# EAGLE schematic RPi (EAGLE 9.5.1)
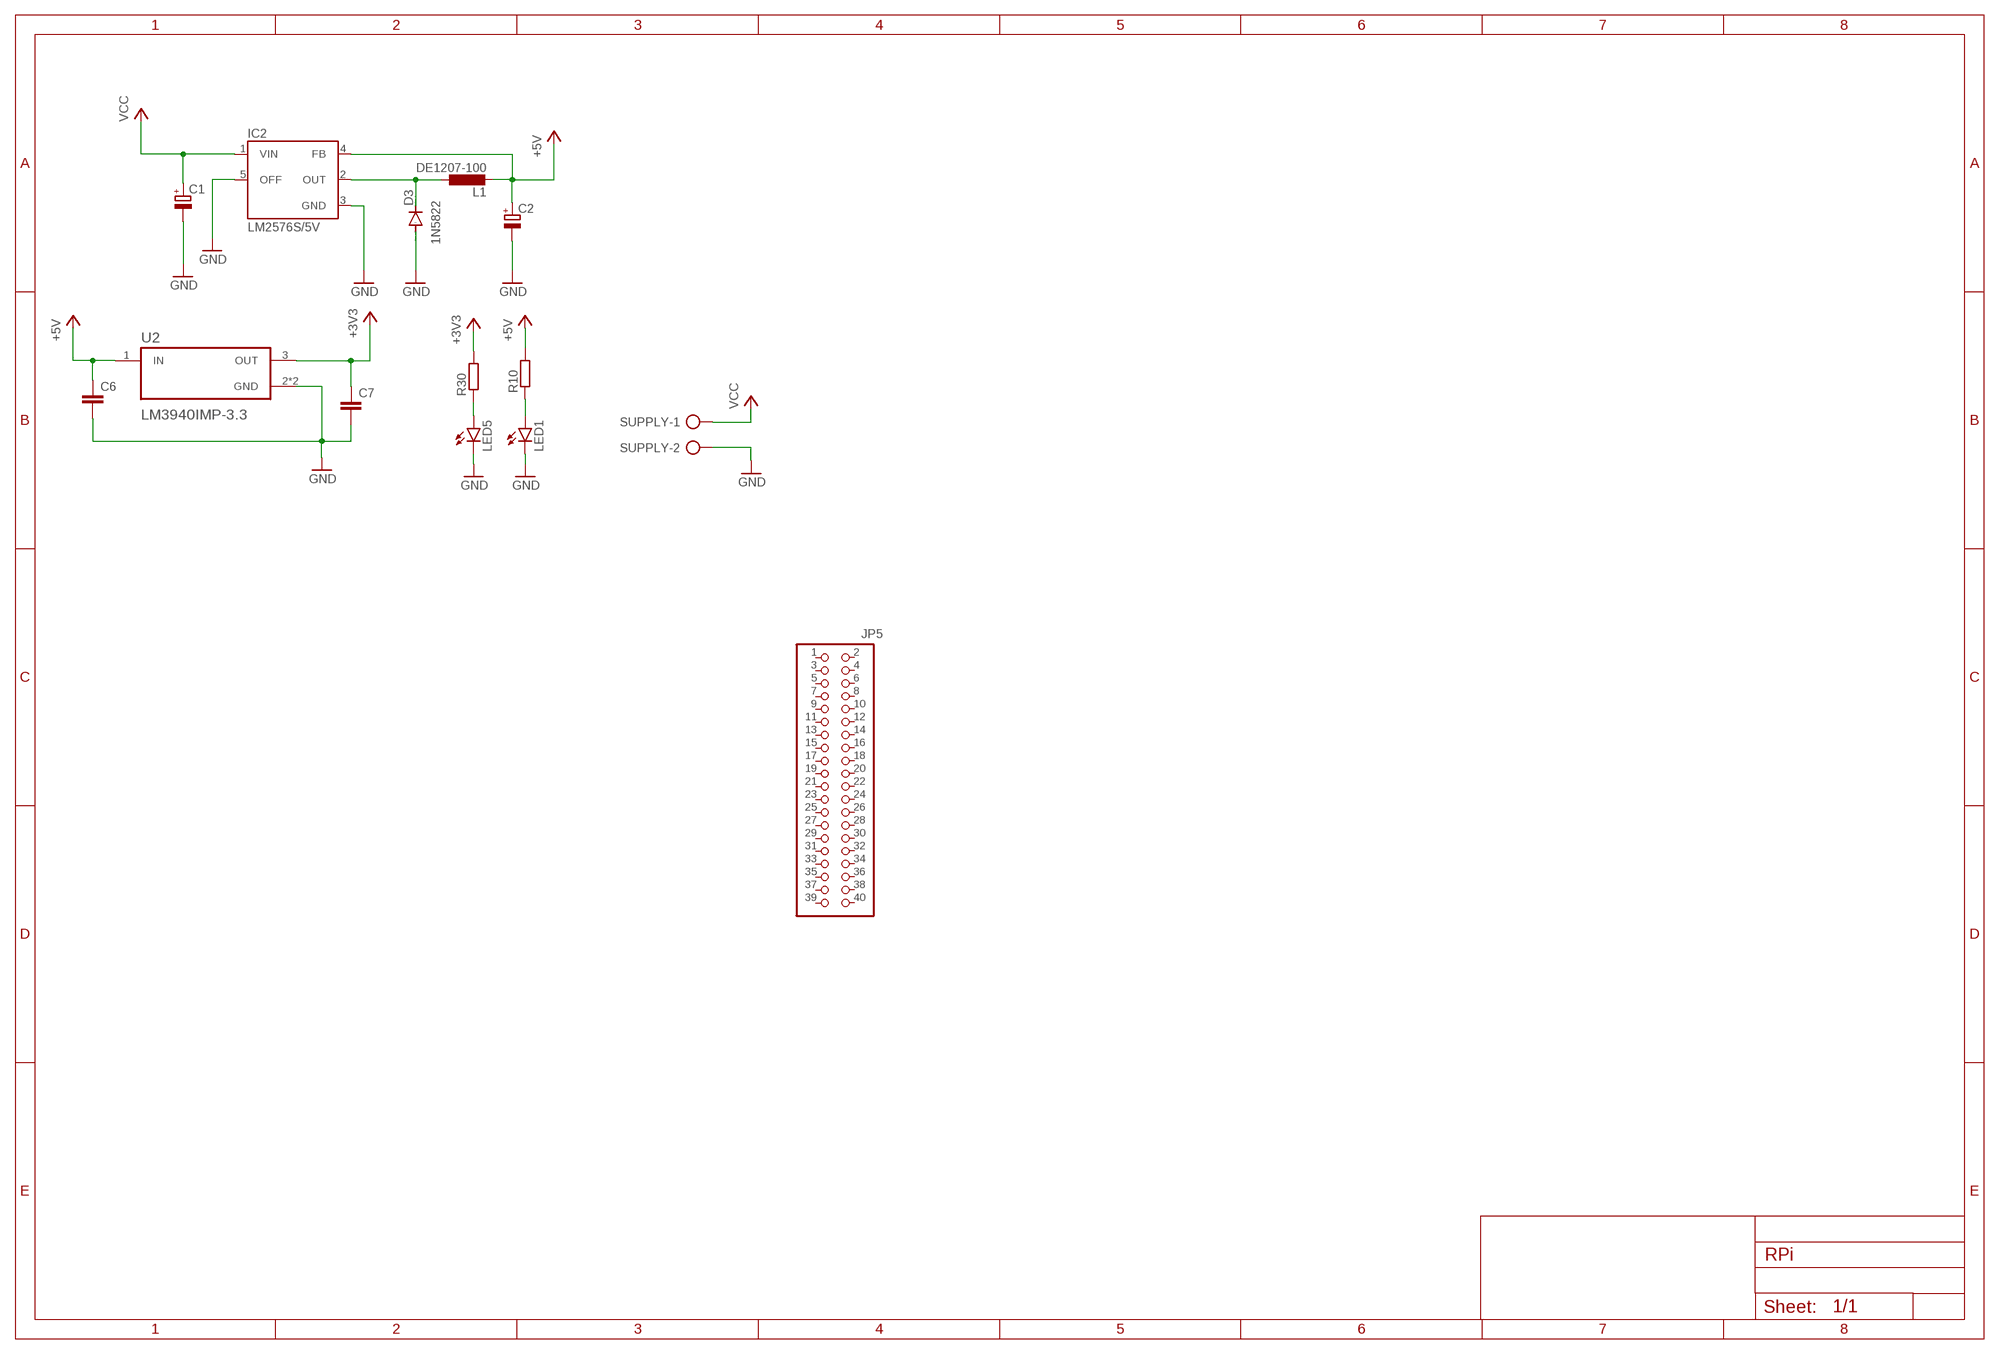
[diagram p0: schematic, sheet 1]

## Parts
C1  CPOL-EUE2.5-6  [E2,5-6]
C2  CPOL-EUE2.5-6  [E2,5-6]
C6  C-EUC0805K  [C0805K]
C7  C-EUC0805K  [C0805K]
D3  1N5822  1N4004  [DO41-10]
IC2  LM2576S/5V  LM2576S  [TO263-5]
JP5  PINHD-2X20  [2X20]
L1  DE1207-100  [DE1207]
LED1  LEDSML0805  [SML0805]
LED5  LEDSML0805  [SML0805]
R10  R-EU_R0805  [R0805]
R30  R-EU_R0805  [R0805]
SUPPLY  AK500/2-H  [AK500/2-H]
U2  LM3940IMP-3.3  [SOT230P700X180-4N]

## Nets
+3V3: C7.1 R30.2 U2.3(OUT)
+5V: C2.+ C6.1 IC2.4(FB) L1.2 R10.2 U2.1(IN)
GND: C1.- C2.- C6.2 C7.2 D3.A IC2.3(GND) IC2.5(OFF) LED1.C LED5.C SUPPLY.2 U2.2(GND) U2.4(GND)
N$3: LED1.A R10.1
N$19: D3.C IC2.2(OUT) L1.1
N$23: LED5.A R30.1
VCC: C1.+ IC2.1(VIN) SUPPLY.1
Unconnected: JP5.1 JP5.2 JP5.3 JP5.4 JP5.5 JP5.6 JP5.7 JP5.8 JP5.9 JP5.10 JP5.11 JP5.12 JP5.13 JP5.14 JP5.15 JP5.16 JP5.17 JP5.18 JP5.19 JP5.20 JP5.21 JP5.22 JP5.23 JP5.24 JP5.25 JP5.26 JP5.27 JP5.28 JP5.29 JP5.30 JP5.31 JP5.32 JP5.33 JP5.34 JP5.35 JP5.36 JP5.37 JP5.38 JP5.39 JP5.40

## Library data of the parts
C1 C2 = rcl:CPOL-EU: POLARIZED CAPACITOR, European symbol; SPICEPREFIX: C
C6 C7 = rcl:C-EU: CAPACITOR, European symbol; SPICEPREFIX: C
D3 = diode:1N4004: DIODE general purpose rectifier, 1 A
IC2 = v-reg-3:LM2576: National Semiconductor <http://www.national.com> 3.0A "Simple Switcher"(c) 52kHz, Vout 1.23-37V (HV: 57V), Vin 40V (HV: 60V), 50µA standby current
JP5 = pinhead:PINHD-2X20: PIN HEADER
L1 = ferrocore:DE1207-100: SMD power coil 100 uH
LED1 LED5 = led:LED: LED OSRAM: - CHIPLED LG R971, LG N971, LY N971, LG Q971, LY Q971, LO R971, LY R971 LH N974, LH R974 LS Q976, LO Q976, LY Q976 LO Q996 - Hyper CHIPLED LW Q18S LB Q993, LB Q99A, LB R99A - SideLED LS A670, LO A670, LY A670, LG A670, LP A670 LB A673, LV A673, LT A673, LW A673 LH A674 LY A675 LS A676, LA A676, LO A676, LY A676, LW A676 LS A679, LY A679, LG A679 - Hyper Micro SIDELED® LS Y876, LA Y876, LO Y876, LY Y876 LT Y87S - SmartLED LW L88C, LW L88S LB L89C, LB L89S, LG L890 LS L89K, LO L89K, LY L89K LS L896, LA L896, LO L896, LY L896 - TOPLED LS T670, LO T670, LY T670, LG T670, LP T670 LSG T670, LSP T670, LSY T670, LOP T670, LYG T670 LG T671, LOG T671, LSG T671 LB T673, LV T673, LT T673, LW T673 LH T674 LS T676, LA T676, LO T676, LY T676, LB T676, LH T676, LSB T676, LW T676 LB T67C, LV T67C, LT T67C, LS T67K, LO T67K, LY T67K, LW E67C LS E67B, LA E67B, LO E67B, LY E67B, LB E67C, LV E67C, LT E67C LW T67C LS T679, LY T679, LG T679 LS T770, LO T770, LY T770, LG T770, LP T770 LB T773, LV T773, LT T773, LW T773 LH T774 LS E675, LA E675, LY E675, LS T675 LS T776, LA T776, LO T776, LY T776, LB T776 LHGB T686 LT T68C, LB T68C - Hyper Mini TOPLED® LB M676 - Mini TOPLED Santana® LG M470 LS M47K, LO M47K, LY M47K Source: http://www.osram.convergy.de LUXEON: - LUMILED® LXK2-PW12-R00, LXK2-PW12-S00, LXK2-PW14-U00, LXK2-PW14-V00 LXK2-PM12-R00, LXK2-PM12-S00, LXK2-PM14-U00 LXK2-PE12-Q00, LXK2-PE12-R00, LXK2-PE12-S00, LXK2-PE14-T00, LXK2-PE14-U00 LXK2-PB12-K00, LXK2-PB12-L00, LXK2-PB12-M00, LXK2-PB14-N00, LXK2-PB14-P00, LXK2-PB14-Q00 LXK2-PR12-L00, LXK2-PR12-M00, LXK2-PR14-Q00, LXK2-PR14-R00 LXK2-PD12-Q00, LXK2-PD12-R00, LXK2-PD12-S00 LXK2-PH12-R00, LXK2-PH12-S00 LXK2-PL12-P00, LXK2-PL12-Q00, LXK2-PL12-R00 Source: www.luxeon.com KINGBRIGHT: KA-3528ASYC Source: www.kingbright.com
R10 R30 = rcl:R-EU_: RESISTOR, European symbol; SPICEPREFIX: R
SUPPLY = con-ptr500:AK500/2-H: CONNECTOR Aug. 2004 / PTR Meßtechnik: Die Bezeichnung der Serie AK505 wurde geändert. Es handelt sich hierbei um AK500 in horizontaler Ausführung.; OC_FARNELL: unknown; OC_NEWARK: unknown
U2 = LM3940IMP-3.3:LM3940IMP-3.3: Check prices <https://pricing.snapeda.com/search/part/LM3940IMP-3.3/?ref=eda>; AVAILABILITY: Warning; DESCRIPTION: 1-A, low-dropout voltage regulator for 5-V to 3.3-V conversion 4-SOT-223 -40 to 125; MF: Texas Instruments; MP: LM3940IMP-3.3; PACKAGE: SOT-223-4 Texas Instruments; PRICE: None; PURCHASE-URL: https://pricing.snapeda.com/search/part/LM3940IMP-3.3/?ref=eda